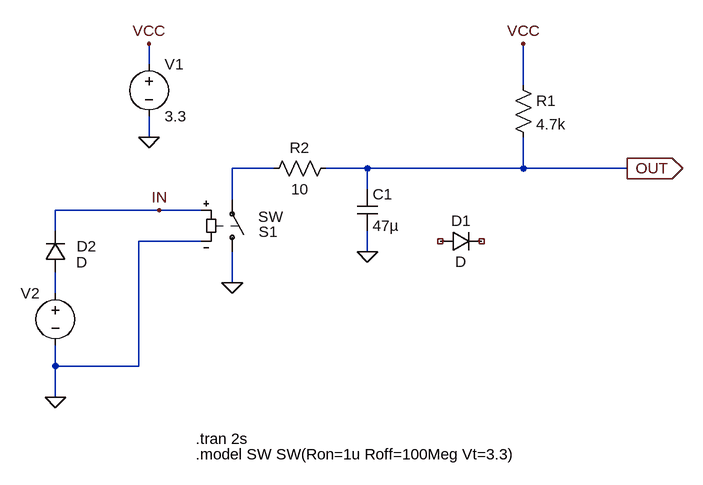
[diagram p0: schematic v1.0.asc]
v1.0.asc, the LTspice schematic file:
Version 4.1
SHEET 1 1020 680
WIRE 176 32 176 0
WIRE 752 64 752 0
WIRE 176 144 176 112
WIRE 368 192 304 192
WIRE 512 192 448 192
WIRE 752 192 752 144
WIRE 752 192 512 192
WIRE 912 192 752 192
WIRE 512 224 512 192
WIRE 304 240 304 192
WIRE 192 256 32 256
WIRE 256 256 192 256
WIRE 32 288 32 256
WIRE 256 304 160 304
WIRE 512 320 512 288
WIRE 304 368 304 320
WIRE 32 384 32 352
WIRE 32 496 32 464
WIRE 160 496 160 304
WIRE 160 496 32 496
WIRE 32 544 32 496
FLAG 176 144 0
FLAG 912 192 OUT
IOPIN 912 192 Out
FLAG 192 256 IN
FLAG 304 368 0
FLAG 512 320 0
FLAG 32 544 0
FLAG 176 0 VCC
FLAG 752 0 VCC
SYMBOL sw 304 336 M180
WINDOW 0 41 47 Left 2
WINDOW 3 40 70 Left 2
SYMATTR InstName S1
SYMBOL res 736 48 R0
SYMATTR InstName R1
SYMATTR Value 4.7k
SYMBOL voltage 176 16 R0
WINDOW 123 0 0 Left 0
WINDOW 39 0 0 Left 0
SYMATTR InstName V1
SYMATTR Value 3.3
SYMBOL voltage 32 368 M0
WINDOW 3 41 64 Invisible 2
WINDOW 123 0 0 Left 0
WINDOW 39 39 69 Left 2
SYMATTR Value PULSE(0 5 0.5 1n 1n 50m 80m 1)
SYMATTR InstName V2
SYMBOL cap 496 224 R0
SYMATTR InstName C1
SYMATTR Value 47µ
SYMATTR SpiceLine Rser=0.05
SYMBOL diode 16 352 M180
WINDOW 0 49 40 Left 2
WINDOW 3 48 16 Left 2
SYMATTR InstName D2
SYMBOL res 464 176 R90
WINDOW 0 0 56 VBottom 2
WINDOW 3 32 56 VTop 2
SYMATTR InstName R2
SYMATTR Value 10
SYMBOL diode 624 320 R270
WINDOW 0 32 32 VTop 2
WINDOW 3 0 32 VBottom 2
SYMATTR InstName D1
TEXT 248 608 Left 2 !.tran 2s
TEXT 248 632 Left 2 !.model SW SW(Ron=1u Roff=100Meg Vt=3.3)

The netlist it stands for:
* v1.0.asc
S1 0 N001 IN 0 SW
R1 VCC OUT 4.7k
V1 VCC 0 3.3
V2 N002 0 PULSE(0 5 0.5 1n 1n 50m 80m 1)
C1 OUT 0 47µ Rser=0.05
D2 N002 IN D
R2 OUT N001 10
D1 NC_01 NC_02 D
.model D D
.lib standard.dio
.tran 2s
.model SW SW(Ron=1u Roff=100Meg Vt=3.3)
.backanno
.end